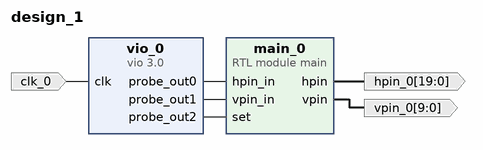
[diagram p0: block diagram of the top level]
# Vivado block design design_1, xc7z010clg400-1, Vivado 2023.2
create_bd_design design_1

create_bd_port -dir I -type clk clk_0
create_bd_port -dir O -from 19 -to 0 hpin_0
create_bd_port -dir O -from 9 -to 0 vpin_0

create_bd_cell -type ip -vlnv xilinx.com:ip:vio:3.0 vio_0
set_property -dict [list \
  CONFIG.C_NUM_PROBE_IN 0 \
  CONFIG.C_NUM_PROBE_OUT 3 \
  CONFIG.C_PROBE_OUT0_WIDTH 20 \
  CONFIG.C_PROBE_OUT1_WIDTH 10 \
] [get_bd_cells vio_0]
create_bd_cell -type module -reference main main_0

# ---- connections ----

connect_bd_net -net clk_0_1 [get_bd_ports clk_0] [get_bd_pins vio_0/clk]
connect_bd_net [get_bd_pins main_0/hpin] [get_bd_ports hpin_0]
connect_bd_net [get_bd_pins main_0/vpin] [get_bd_ports vpin_0]
connect_bd_net [get_bd_pins vio_0/probe_out0] [get_bd_pins main_0/hpin_in]
connect_bd_net [get_bd_pins vio_0/probe_out1] [get_bd_pins main_0/vpin_in]
connect_bd_net [get_bd_pins vio_0/probe_out2] [get_bd_pins main_0/set]

validate_bd_design
save_bd_design
